# EAGLE design brick_4pin_breakout (EAGLE 7.3.0)
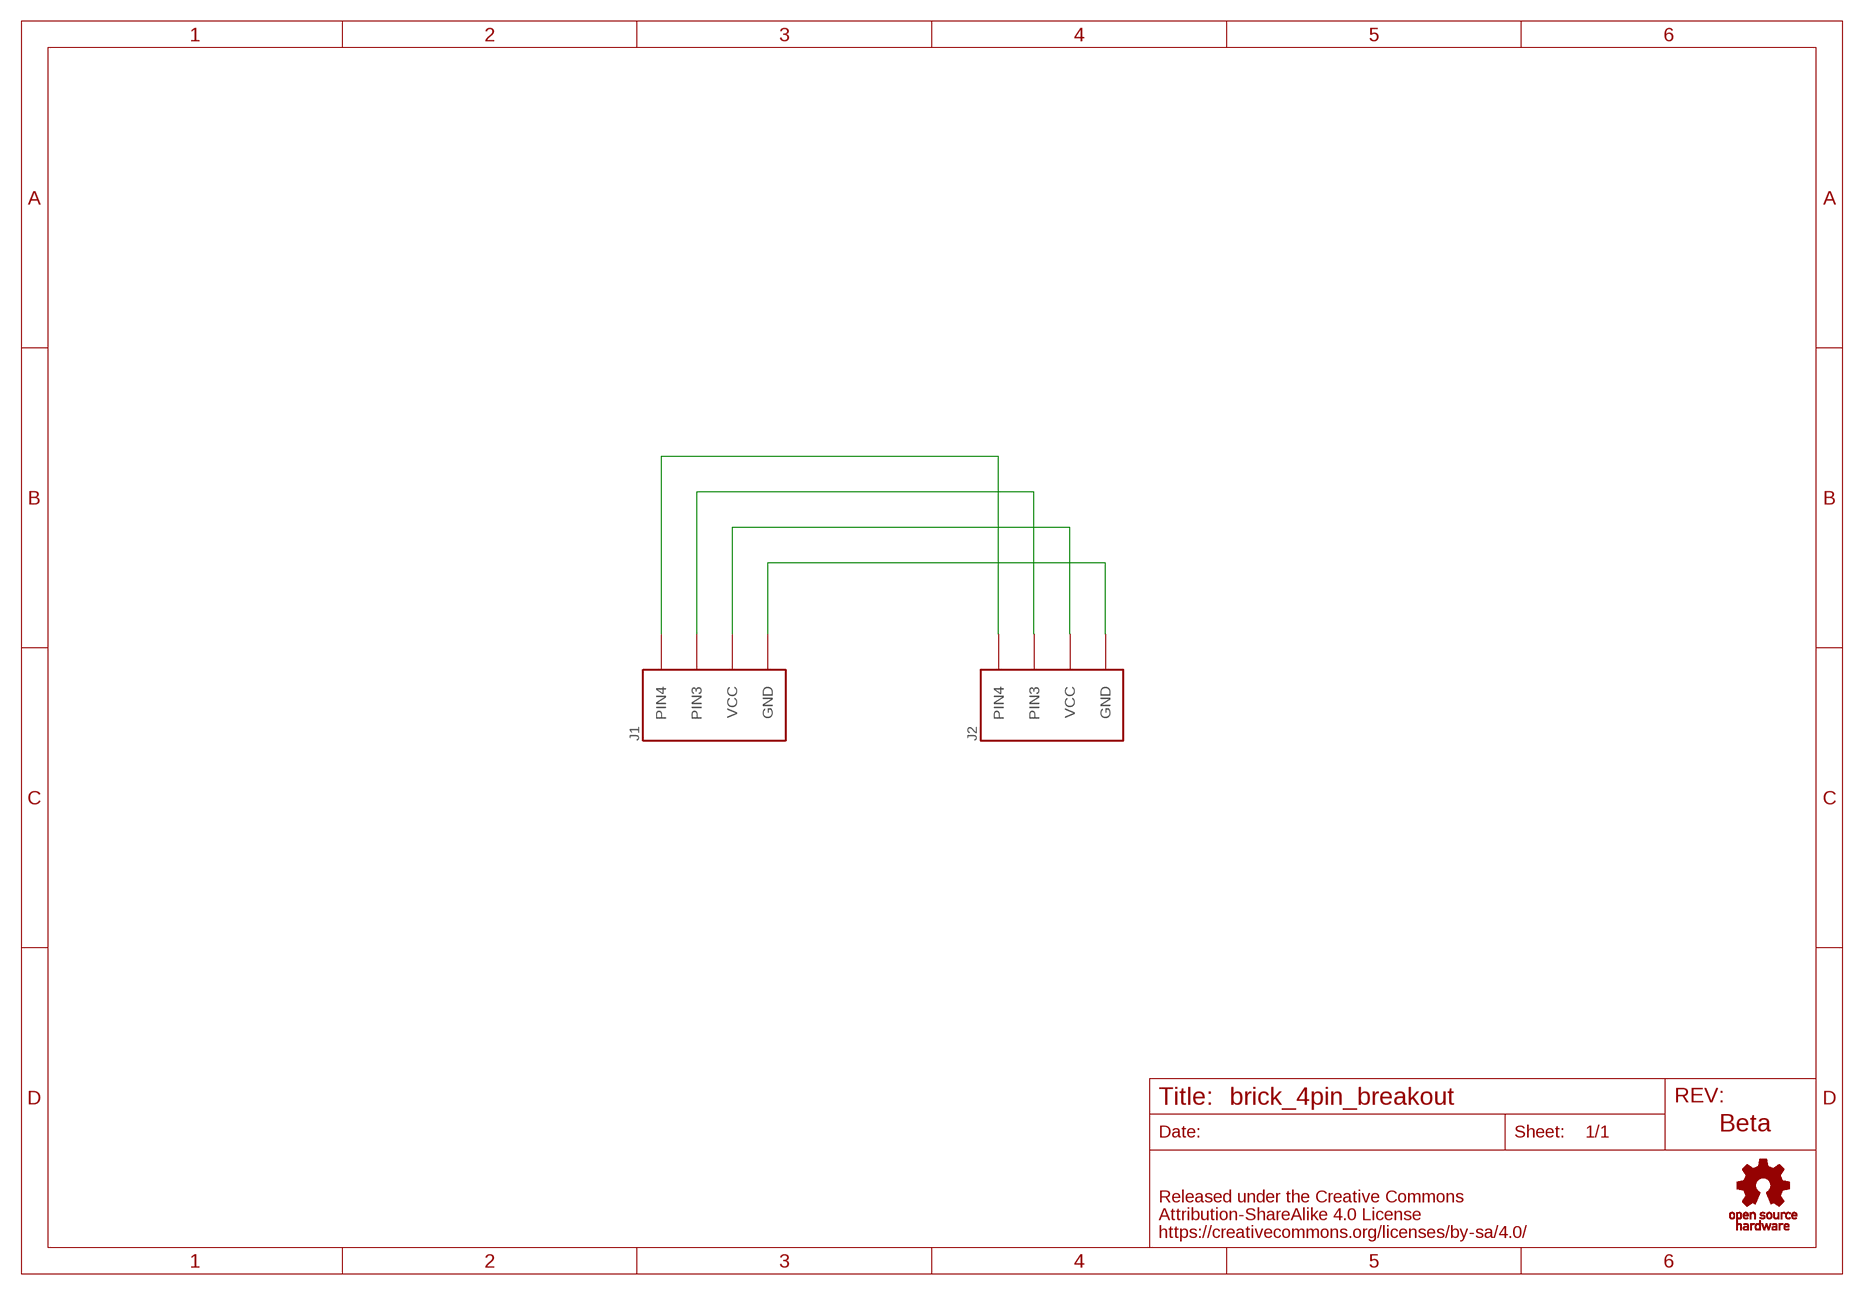
[diagram p0: schematic, sheet 1]

## Parts
J1  BRICK_4PIN_BREAKOUT  [BRICK_4PIN_BREAKOUT]
J2  BRICK_4PIN_CONNECTOR  [BRICK_4PIN_CONNECTOR]
U$2  LOGO_OSHW_T-BT  [LOGO_OSHW_T_M_BOTTOM]

## Nets
GND: J1.GND J2.GND
PIN3: J1.PIN3 J2.PIN3
PIN4: J1.PIN4 J2.PIN4
VCC: J1.VCC J2.VCC

## Notes on the sheet
- Beta

## Library data of the parts
J1 J2 = FaBo-etc:BRICK_4PIN
U$2 = FaBo-etc:LOGO_OSHW_T

## Board
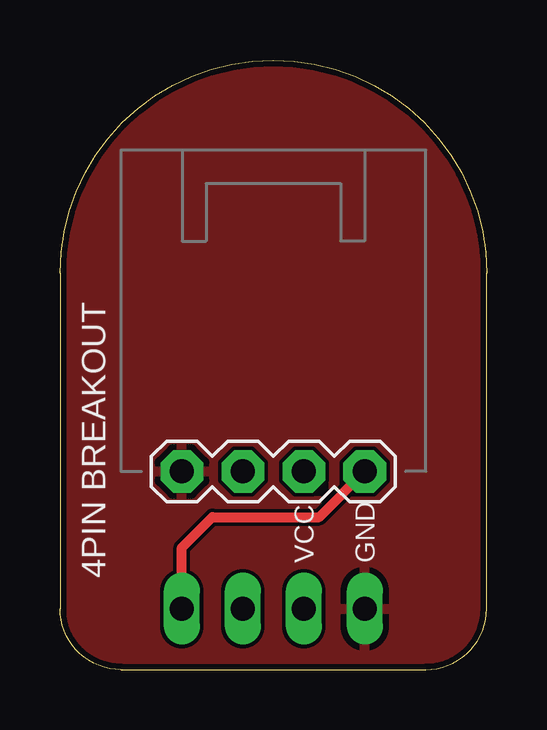
[diagram p1: board, top side]
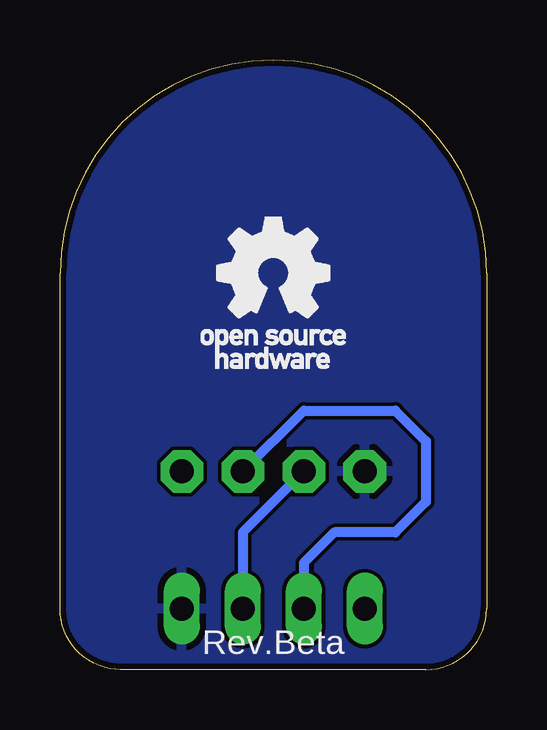
[diagram p2: board, bottom side, seen from below]

Size 17.78 x 25.4 mm. Coordinates in mm from the lower left corner, seen from the top.
Copper layers (1*16): Top 0.035mm / dielectric 1.5mm / Bottom 0.035mm
Design rules "Elecrow_2-layer_eagle_rule": minimum track width 6mil, minimum drill 12mil, track to track 6mil, track to pad 6mil, pad to pad 6mil, via to via 6mil, smd to smd 0mil, copper to edge 10mil, drill to drill 10mil, minimum pad ring 10mil, minimum via ring 6mil, stop-mask expansion 2mil, vias tented up to drill 100mil, thermal gap 10mil

### Footprints (pad centres in the part's own frame; a part is rotated, then mirrored left to right if it is on the bottom)
BRICK_4PIN_BREAKOUT = drill 1 long: GND 3.81,0; PIN3 -1.27,0; PIN4 -3.81,0; VCC 1.27,0
BRICK_4PIN_CONNECTOR = drill 1 pad 1.778 octagon: GND -3.81,0; PIN3 1.27,0; PIN4 3.81,0; VCC -1.27,0

### Placement (x,y rotation side)
J1  8.89,2.54 0 top
J2  8.89,8.26 0 top
U$2  8.89,16.51 0 top

### Tracks (layer width: path | path; a pad name or v marks a point on that pad's centre or on a via)
GND
  pour Top: -1.27,-1.27 19.05,-1.27 19.05,26.67 -1.27,26.67
  pour Bottom: -1.27,-1.27 19.05,-1.27 19.05,26.67 -1.27,26.67
PIN3
  Bottom 0.406: J2.PIN3 7.62,10.79 3.81,10.79 2.54,9.53 2.54,6.99 3.81,5.71 6.35,5.71 7.62,4.45 J1.PIN3
PIN4
  Top 0.406: J1.PIN4 5.08,5.08 6.35,6.35 10.79,6.35 J2.PIN4
VCC
  Bottom 0.406: J2.VCC 10.16,5.71 J1.VCC

### Text on the board
tPlace: 4PIN BREAKOUT
bPlace: Rev.Beta